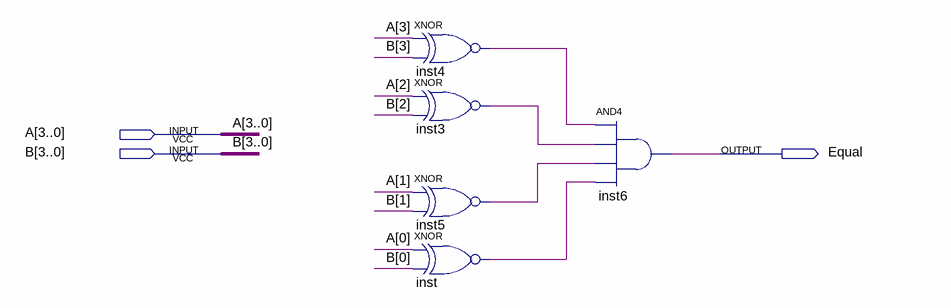
[diagram p0: schematic sheet]
// Quartus schematic comparator.bdf as structural Verilog: 5 symbols, 3 pins
module comparator (
  input  [3:0] A,
  input  [3:0] B,
  output Equal
);

  wire inst3_out, inst4_out, inst5_out, inst_out;

  xnor inst4 (inst4_out, A[3], B[3]);
  xnor inst3 (inst3_out, A[2], B[2]);
  xnor inst5 (inst5_out, A[1], B[1]);
  xnor inst (inst_out, A[0], B[0]);
  and inst6 (Equal, inst4_out, inst3_out, inst5_out, inst_out);
endmodule
